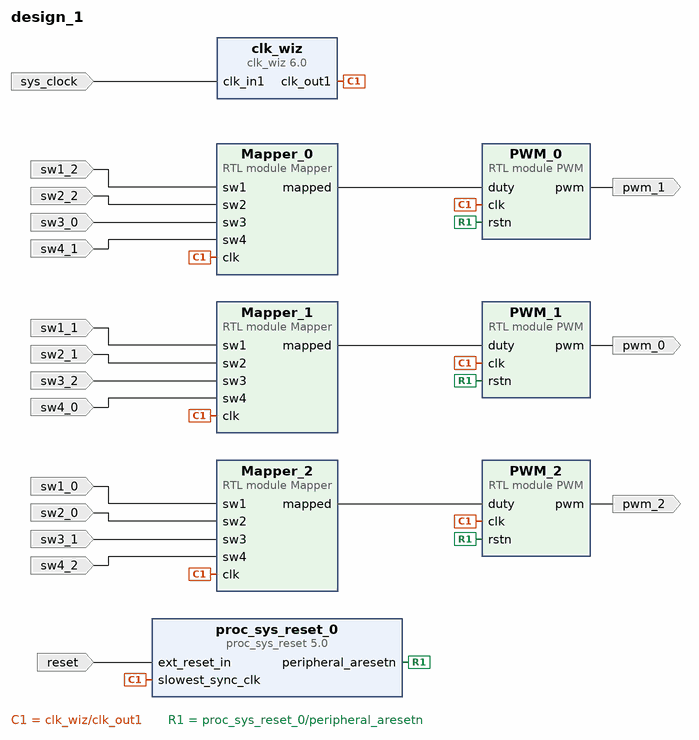
[diagram p0: block diagram of the top level]
# Vivado block design design_1, xc7a100tcsg324-1, Vivado 2023.1
create_bd_design design_1

create_bd_port -dir I -type clk sys_clock
set_property -dict {CONFIG.FREQ_HZ 100000000 CONFIG.PHASE 0.0} [get_bd_ports sys_clock]
create_bd_port -dir I -type rst reset
set_property -dict {CONFIG.POLARITY ACTIVE_LOW} [get_bd_ports reset]
create_bd_port -dir I sw4_0
create_bd_port -dir I sw3_0
create_bd_port -dir I sw4_1
create_bd_port -dir I sw1_0
create_bd_port -dir I sw2_0
create_bd_port -dir I sw1_1
create_bd_port -dir I sw2_1
create_bd_port -dir I sw3_1
create_bd_port -dir I sw2_2
create_bd_port -dir I sw4_2
create_bd_port -dir I sw3_2
create_bd_port -dir I sw1_2
create_bd_port -dir O pwm_0
create_bd_port -dir O pwm_1
create_bd_port -dir O pwm_2

create_bd_cell -type ip -vlnv xilinx.com:ip:clk_wiz:6.0 clk_wiz
set_property -dict [list \
  CONFIG.CLK_IN1_BOARD_INTERFACE sys_clock \
  CONFIG.RESET_BOARD_INTERFACE reset \
  CONFIG.RESET_PORT resetn \
  CONFIG.RESET_TYPE ACTIVE_LOW \
  CONFIG.USE_BOARD_FLOW true \
  CONFIG.USE_LOCKED false \
  CONFIG.USE_RESET false \
] [get_bd_cells clk_wiz]
create_bd_cell -type ip -vlnv xilinx.com:ip:proc_sys_reset:5.0 proc_sys_reset_0
create_bd_cell -type module -reference PWM PWM_0
create_bd_cell -type module -reference PWM PWM_1
create_bd_cell -type module -reference PWM PWM_2
create_bd_cell -type module -reference Mapper Mapper_0
create_bd_cell -type module -reference Mapper Mapper_1
create_bd_cell -type module -reference Mapper Mapper_2

# ---- connections ----

connect_bd_net [get_bd_pins Mapper_0/mapped] [get_bd_pins PWM_0/duty]
connect_bd_net [get_bd_pins Mapper_1/mapped] [get_bd_pins PWM_1/duty]
connect_bd_net [get_bd_pins Mapper_2/mapped] [get_bd_pins PWM_2/duty]
connect_bd_net [get_bd_pins PWM_0/pwm] [get_bd_ports pwm_1]
connect_bd_net [get_bd_pins PWM_1/pwm] [get_bd_ports pwm_0]
connect_bd_net [get_bd_pins PWM_2/pwm] [get_bd_ports pwm_2]
connect_bd_net [get_bd_pins clk_wiz/clk_out1] \
  [get_bd_pins proc_sys_reset_0/slowest_sync_clk] [get_bd_pins PWM_0/clk] [get_bd_pins PWM_1/clk] [get_bd_pins PWM_2/clk] \
  [get_bd_pins Mapper_0/clk] [get_bd_pins Mapper_1/clk] [get_bd_pins Mapper_2/clk]
connect_bd_net [get_bd_pins proc_sys_reset_0/peripheral_aresetn] [get_bd_pins PWM_0/rstn] [get_bd_pins PWM_1/rstn] [get_bd_pins PWM_2/rstn]
connect_bd_net [get_bd_ports reset] [get_bd_pins proc_sys_reset_0/ext_reset_in]
connect_bd_net -net sw1_0_1 [get_bd_ports sw1_0] [get_bd_pins Mapper_2/sw1]
connect_bd_net -net sw1_1_1 [get_bd_ports sw1_1] [get_bd_pins Mapper_1/sw1]
connect_bd_net -net sw1_2_1 [get_bd_ports sw1_2] [get_bd_pins Mapper_0/sw1]
connect_bd_net -net sw2_0_1 [get_bd_ports sw2_0] [get_bd_pins Mapper_2/sw2]
connect_bd_net -net sw2_1_1 [get_bd_ports sw2_1] [get_bd_pins Mapper_1/sw2]
connect_bd_net -net sw2_2_1 [get_bd_ports sw2_2] [get_bd_pins Mapper_0/sw2]
connect_bd_net -net sw3_0_1 [get_bd_ports sw3_0] [get_bd_pins Mapper_0/sw3]
connect_bd_net -net sw3_1_1 [get_bd_ports sw3_1] [get_bd_pins Mapper_2/sw3]
connect_bd_net -net sw3_2_1 [get_bd_ports sw3_2] [get_bd_pins Mapper_1/sw3]
connect_bd_net -net sw4_0_1 [get_bd_ports sw4_0] [get_bd_pins Mapper_1/sw4]
connect_bd_net -net sw4_1_1 [get_bd_ports sw4_1] [get_bd_pins Mapper_0/sw4]
connect_bd_net -net sw4_2_1 [get_bd_ports sw4_2] [get_bd_pins Mapper_2/sw4]
connect_bd_net [get_bd_ports sys_clock] [get_bd_pins clk_wiz/clk_in1]

validate_bd_design
save_bd_design
